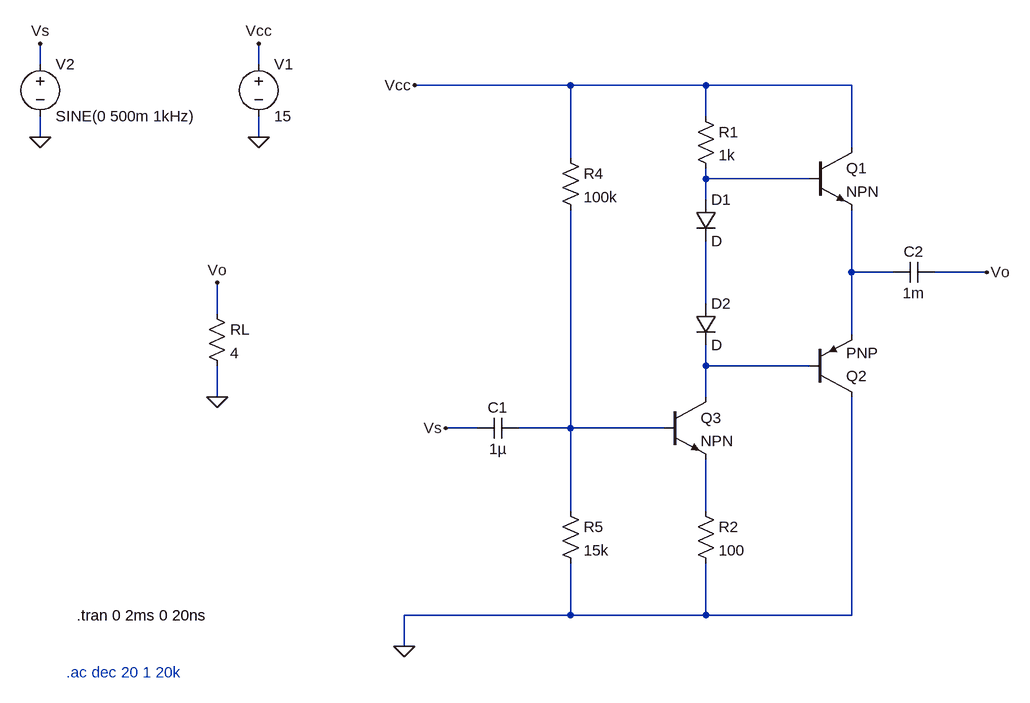
[diagram p0: schematic ab-signal-amp.asc]
ab-signal-amp.asc, the LTspice schematic file:
Version 4
SHEET 1 880 824
WIRE -880 -128 -880 -160
WIRE -544 -128 -544 -160
WIRE -64 -96 -304 -96
WIRE 144 -96 -64 -96
WIRE 368 -96 144 -96
WIRE 144 -48 144 -96
WIRE -880 -16 -880 -48
WIRE -544 -16 -544 -48
WIRE 368 0 368 -96
WIRE -64 16 -64 -96
WIRE 144 48 144 32
WIRE 304 48 144 48
WIRE 144 80 144 48
WIRE 368 192 368 96
WIRE 432 192 368 192
WIRE 576 192 496 192
WIRE 144 240 144 144
WIRE -608 256 -608 208
WIRE 368 288 368 192
WIRE 144 336 144 304
WIRE 304 336 144 336
WIRE -608 384 -608 336
WIRE 144 384 144 336
WIRE -208 432 -256 432
WIRE -64 432 -64 96
WIRE -64 432 -144 432
WIRE 80 432 -64 432
WIRE -64 560 -64 432
WIRE 144 560 144 480
WIRE -64 720 -64 640
WIRE -64 720 -320 720
WIRE 144 720 144 640
WIRE 144 720 -64 720
WIRE 368 720 368 384
WIRE 368 720 144 720
WIRE -320 768 -320 720
FLAG -544 -16 0
FLAG -544 -160 Vcc
FLAG -304 -96 Vcc
FLAG -320 768 0
FLAG -880 -160 Vs
FLAG -880 -16 0
FLAG 576 192 Vo
FLAG -256 432 Vs
FLAG -608 208 Vo
FLAG -608 384 0
SYMBOL npn 304 0 R0
SYMATTR InstName Q1
SYMBOL pnp 304 384 M180
SYMATTR InstName Q2
SYMBOL voltage -544 -144 R0
WINDOW 123 0 0 Left 0
WINDOW 39 0 0 Left 0
SYMATTR InstName V1
SYMATTR Value 15
SYMBOL res 128 -64 R0
SYMATTR InstName R1
SYMATTR Value 1k
SYMBOL res 128 544 R0
SYMATTR InstName R2
SYMATTR Value 100
SYMBOL diode 128 80 R0
SYMATTR InstName D1
SYMBOL diode 128 240 R0
SYMATTR InstName D2
SYMBOL voltage -880 -144 R0
WINDOW 123 24 44 Left 2
WINDOW 39 0 0 Left 0
SYMATTR InstName V2
SYMATTR Value SINE(0 500m 1kHz)
SYMBOL res -624 240 R0
SYMATTR InstName RL
SYMATTR Value 4
SYMBOL cap -144 416 R90
WINDOW 0 0 32 VBottom 2
WINDOW 3 32 32 VTop 2
SYMATTR InstName C1
SYMATTR Value 1µ
SYMBOL npn 80 384 R0
SYMATTR InstName Q3
SYMBOL res -80 0 R0
SYMATTR InstName R4
SYMATTR Value 100k
SYMBOL res -80 544 R0
SYMATTR InstName R5
SYMATTR Value 15k
SYMBOL cap 496 176 R90
WINDOW 0 0 32 VBottom 2
WINDOW 3 32 32 VTop 2
SYMATTR InstName C2
SYMATTR Value 1m
TEXT -840 808 Left 2 ;.ac dec 20 1 20k
TEXT -824 720 Left 2 !.tran 0 2ms 0 20ns

The netlist it stands for:
* ab-signal-amp.asc
Q1 Vcc N001 N002 0 NPN
Q2 0 N004 N002 0 PNP
V1 Vcc 0 15
R1 Vcc N001 1k
R2 N006 0 100
D1 N001 N003 D
D2 N003 N004 D
V2 Vs 0 SINE(0 500m 1kHz)
RL Vo 0 4
C1 N005 Vs 1µ
Q3 N004 N005 N006 0 NPN
R4 Vcc N005 100k
R5 N005 0 15k
C2 Vo N002 1m
.model D D
.lib standard.dio
.model NPN NPN
.model PNP PNP
.lib standard.bjt
* .ac dec 20 1 20k
.tran 0 2ms 0 20ns
.backanno
.end